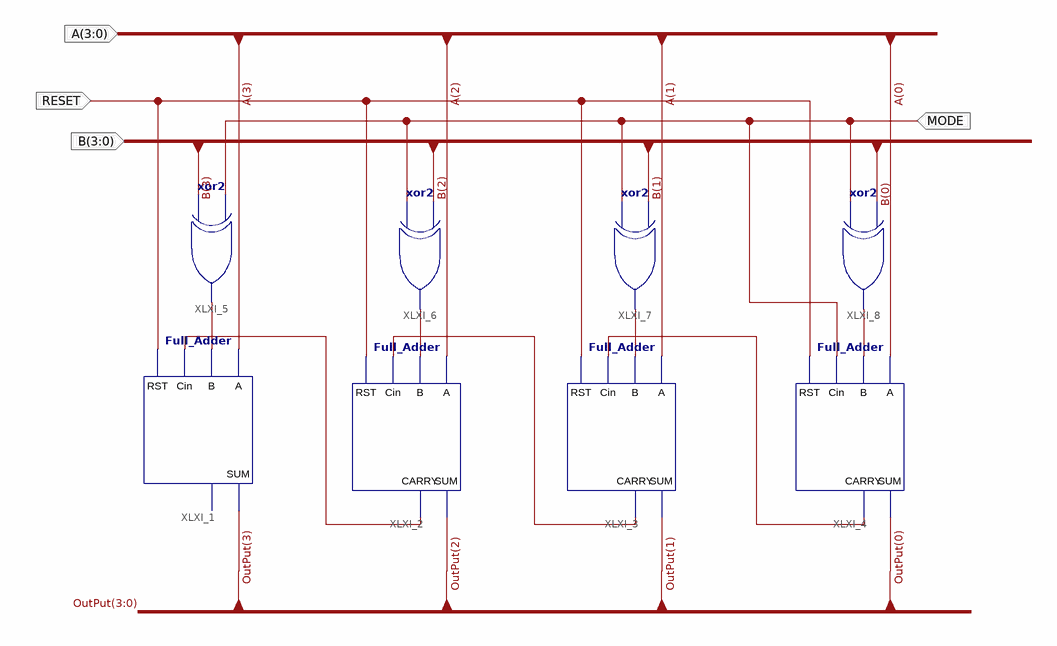
[diagram p0: schematic sheet 1]
// Xilinx ISE schematic Adder_Subtracter.sch (spartan6) as structural Verilog: 8 symbols, 4 ports
module Adder_Subtracter (
  input  RESET,
  input  MODE,
  input  [3:0] A,
  input  [3:0] B
);

  wire XLXN_2, XLXN_4, XLXN_6, XLXN_15, XLXN_16, XLXN_17, XLXN_18;
  wire [3:0] OutPut;

  Full_Adder XLXI_1 (.A(A[3]), .B(XLXN_15), .Cin(XLXN_2), .RST(RESET), .SUM(OutPut[3]));  // open: CARRY
  Full_Adder XLXI_2 (.A(A[2]), .B(XLXN_16), .CARRY(XLXN_2), .Cin(XLXN_4), .RST(RESET), .SUM(OutPut[2]));
  Full_Adder XLXI_3 (.A(A[1]), .B(XLXN_17), .CARRY(XLXN_4), .Cin(XLXN_6), .RST(RESET), .SUM(OutPut[1]));
  Full_Adder XLXI_4 (.A(A[0]), .B(XLXN_18), .CARRY(XLXN_6), .Cin(MODE), .RST(RESET), .SUM(OutPut[0]));
  xor XLXI_5 (XLXN_15, B[3], MODE);
  xor XLXI_6 (XLXN_16, MODE, B[2]);
  xor XLXI_7 (XLXN_17, MODE, B[1]);
  xor XLXI_8 (XLXN_18, MODE, B[0]);
endmodule
